# EasyEDA Pro project flyBuck_test.eprj

# Schematic Schematic1
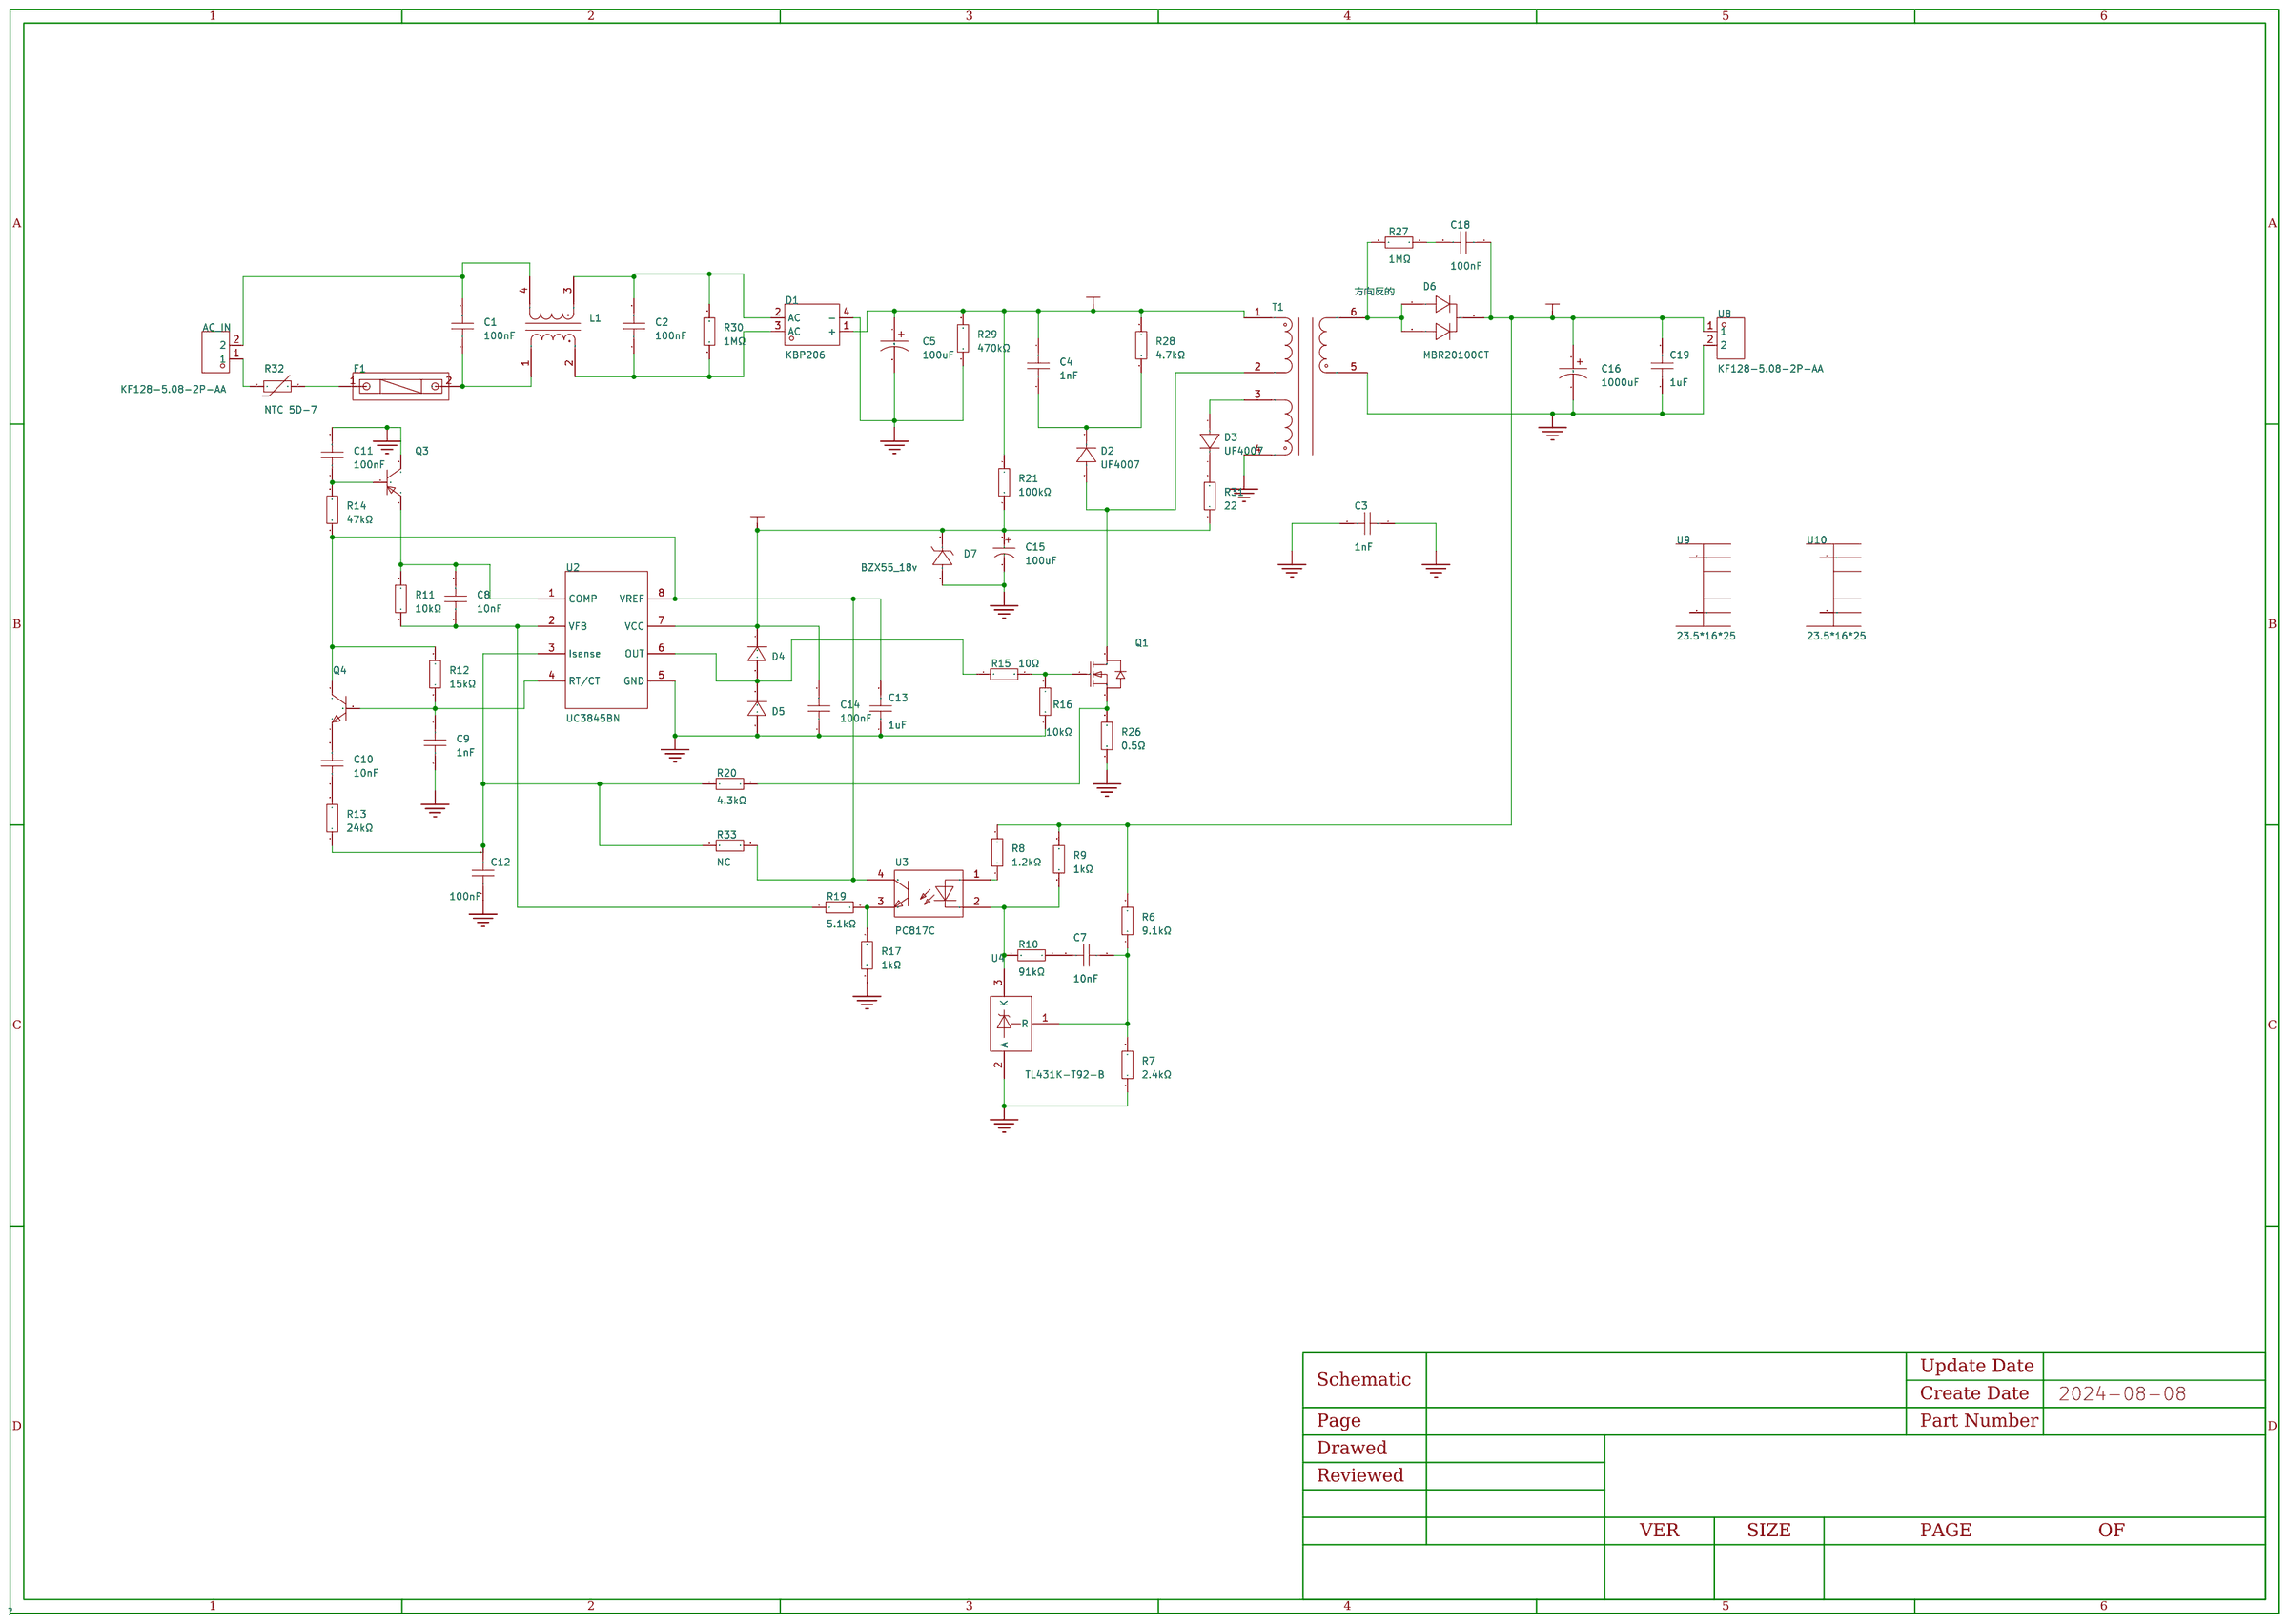
[diagram p0: schematic sheet]

## Parts
AC_IN  KF128-5.08-2P-AA  [CONN-TH_P5.08_KF128-5.08-2P]
C1  100nF  [CAP-TH_L13.0-W6.0-P10.0-D0.6]
C2  100nF  [CAP-TH_L13.0-W6.0-P10.0-D0.6]
C3  1nF  [CAP-TH_L7.0-W3.5-P10.00-D0.6]
C4  1nF  [CAP-TH_L7.0-W3.5-P10.00-D0.6]
C5  100uF  [CAP-TH_BD22.0-P10.00-D2.2-FD]
C7  10nF  [CAP-TH_L5.8-W2.4-P2.54-D0.6]
C8  10nF  [CAP-TH_L5.8-W2.4-P2.54-D0.6]
C9  1nF  [CAP-TH_L5.8-W2.4-P2.54-D0.6]
C10  10nF  [CAP-TH_L5.8-W2.4-P2.54-D0.6]
C11  100nF  [CAP-TH_L5.8-W2.4-P2.54-D0.6]
C12  100nF  [CAP-TH_L5.8-W2.4-P2.54-D0.6]
C13  1uF  [CAP-TH_L6.0-W4.0-P5.00-D1.2]
C14  100nF  [CAP-TH_L5.8-W2.4-P2.54-D0.6]
C15  100uF  [CAP-TH_BD6.3-P2.50-D1.0-FD]
C16  1000uF  [CAP-TH_BD10.0-P5.00-D1.0-FD]
C18  100nF  [CAP-TH_L5.8-W2.4-P2.54-D0.6]
C19  1uF  [CAP-TH_L6.0-W4.0-P5.00-D1.2]
D1  KBP206  [KBP_4P-L14.5-W3.5-P3.81-L]
D2  UF4007  [DO-41_BD2.4-L4.7-P8.70-D0.9-RD]
D3  UF4007  [DO-41_BD2.4-L4.7-P8.70-D0.9-RD]
D4  1N4148  [DO-35_BD2.0-L4.2-P8.20-D0.5-RD]
D5  1N4148  [DO-35_BD2.0-L4.2-P8.20-D0.5-RD]
D6  MBR20100CT  [TO-220AB-3_L10.4-W4.6-P2.54-T]
D7  BZX55_18v  [DO-35_BD1.7-L3.6-P10.00-D0.5-FD]
F1  5x20 BLX-A型 保险丝支架 XC-7  [FUSE-TH_L22.6-W9.0]
L1  YDUU9.8-103L0301  [FILTER-TH_4P-L16.5-W11.5_YDUU9.8-603L0201]
Q1  FQP6N80C  [TO220_safe600v]
Q3  S8550  [TO-92-3_L5.1-W4.1-P1.27-L]
Q4  S8050  [TO-92-3_L4.5-W3.5-P1.27-L]
R6  9.1kΩ  [RES-TH_BD1.9-L3.3-P7.30-D0.5]
R7  2.4kΩ  [RES-TH_BD1.9-L3.3-P7.30-D0.5]
R8  1.2kΩ  [RES-TH_BD1.9-L3.3-P7.30-D0.5]
R9  1kΩ  [RES-TH_BD1.9-L3.3-P7.30-D0.5]
R10  91kΩ  [RES-TH_BD1.9-L3.3-P7.30-D0.5]
R11  10kΩ  [RES-TH_BD1.9-L3.3-P7.30-D0.5]
R12  15kΩ  [RES-TH_BD1.9-L3.3-P7.30-D0.5]
R13  24kΩ  [RES-TH_BD1.9-L3.3-P7.30-D0.5]
R14  47kΩ  [RES-TH_BD1.9-L3.3-P7.30-D0.5]
R15  10Ω  [RES-TH_BD1.9-L3.3-P7.30-D0.5]
R16  10kΩ  [RES-TH_BD1.9-L3.3-P7.30-D0.5]
R17  1kΩ  [RES-TH_BD1.9-L3.3-P7.30-D0.5]
R19  5.1kΩ  [RES-TH_BD1.9-L3.3-P7.30-D0.5]
R20  4.3kΩ  [RES-TH_BD1.9-L3.3-P7.30-D0.5]
R21  100kΩ  [Resis_3W_ZC_LC]
R26  0.5Ω  [R2010]
R27  1MΩ  [resis_1W_ZC_LC]
R28  4.7kΩ  [Resis_3W_ZC_LC]
R29  470kΩ  [resis_1W_ZC_LC]
R30  1MΩ  [RES-TH_BD2.3-L6.5-P10.50-D0.5]
R31  22  [R1210]
R32  NTC 5D-7  [RES-TH_L8.5-W5.5-P5.00-D0.6-S5.50]
R33  NC  [RES-TH_BD1.9-L3.3-P7.30-D0.5]
T1  -  [EE28_5_5_L]
U2  UC3845BN  [DIP-8_L10.9-W6.6-P2.54-LS7.6-BL]
U3  PC817C  [DIP-4_L4.6-W6.5-P2.54-LS7.6-BL]
U4  TL431K-T92-B  [TO-92-3_L4.9-W3.7-P1.27-L]
U8  KF128-5.08-2P-AA  [CONN-TH_P5.08_KF128-5.08-2P]
U9  23.5*16*25  [HEATSINK-TH_L23.5-W16.0-P18.0_XSD2156-067]
U10  23.5*16*25  [HEATSINK-TH_L23.5-W16.0-P18.0_XSD2156-067]

## Library data of the parts
AC_IN U8 = KF128-5.08-2P-AA: LCSC Part Name: 5.08mm 1x2P 排数:1 每排P数:2 直插; Supplier Part: C474952; Manufacturer: KEFA(科发); Supplier Footprint: 插件,P=5.08mm; JLCPCB Part Class: 扩展库; Datasheet: https://atta.szlcsc.com/upload/public/pdf/source/20230317/DADFED05827EAD48C1D5B8C3D4CF88F4.pdf; Supplier: LCSC; Structure: 1x2P; Pitch: 5.08mm; Color: 绿色; Mounting Style: 直插; Current Rating (Max): 24A; Voltage Rating (Max): 250V; Number of Pins: 2P; Number of Rows: 1; Wire Gauge - AWG: 12~22; Wire Gauge - mm2: 2.5; Number of PINs Per Row: 2; Operating Temperature Range: -40℃~+105℃
C1 C2 = X2-104K-275VAC_C914483: LCSC Part Name: 等级:X2 100nF ±10% 275V; Supplier Part: C914483; Manufacturer: NDF(达孚); Manufacturer Part: X2-104K-275VAC; Supplier Footprint: 插件,P=10mm; JLCPCB Part Class: 扩展库; Datasheet: https://atta.szlcsc.com/upload/public/pdf/source/20210517/C914484_87B6324D9C831D7B5ED24756D36395BD.pdf; Supplier: LCSC; Tolerance: ±10%; Voltage(AC): 275V; Subclass: X2; Operating Temperature: -40℃~+110℃
C3 C4 = Y1680K-E1I-B4-AC400V: LCSC Part Name: 等级:Y1 68pF ±10% 400V; Supplier Part: C3148245; Manufacturer: Dersonic(德尔创); Supplier Footprint: 插件,P=10mm; JLCPCB Part Class: 扩展库; Datasheet: https://atta.szlcsc.com/upload/public/pdf/source/20220706/A63904B1A025BA519904ED28C3950901.pdf; Supplier: LCSC; Tolerance: ±10%; Voltage(AC): 400V; Subclass: Y1; safety certification: UL；CUL；ENEC；VDE；CQC; Operating Temperature: -40℃~+125℃
C5 = 152EC0349: LCSC Part Name: 100uF ±20% 400V; Supplier Part: C5563861; Manufacturer: KNSCHA(科尼盛); Supplier Footprint: 插件,D22xL25mm; JLCPCB Part Class: 扩展库; Datasheet: https://atta.szlcsc.com/upload/public/pdf/source/20230425/64684703988C9F344EAF36C2E534ED51.pdf; Supplier: LCSC; Tolerance: ±20%; Rated Voltage: 400V; Lead Spacing: 10mm; Ripple Current: 630mA@120Hz; φD: 22mm; L: 25mm; Lifetime @ Temperature: 2000hrs@105℃; Operating Temperature: -25℃~+105℃
C7-C12 C14 C18 = CC1H104ZA1ED3F5P1100: LCSC Part Name: 100nF -20%~+80% 50V; Supplier Part: C2832506; Manufacturer: Dersonic(德尔创); Supplier Footprint: 插件,P=2.54mm; JLCPCB Part Class: 扩展库; Datasheet: https://atta.szlcsc.com/upload/public/pdf/source/20211027/619020FDD8EBC9BBFCA73A5584FA164D.pdf; Supplier: LCSC; Tolerance: -20%~+80%; Voltage Rated: 50V; Lead Spacing: 2.54mm; Temperature Coefficient: Y5V; φD: 5.8mm; Body Thickness: 2.4mm
C13 C19 = CT40805B104K500F3: LCSC Part Name: 104K50V P=5  独石电容; Supplier Part: C25168941; Manufacturer: KYET(科雅); Supplier Footprint: 插件,P=5.08mm; Datasheet: https://atta.szlcsc.com/upload/public/pdf/source/20240710/2A9D5485CB0DC7110878DC42BC2098C0.pdf; Supplier: LCSC
C15 = ERS1EM101E11OT: LCSC Part Name: 100uF ±20% 25V; Supplier Part: C112509; Manufacturer: AISHI(艾华集团); Supplier Footprint: 插件,D6.3xL11mm; JLCPCB Part Class: 扩展库; Datasheet: https://atta.szlcsc.com/upload/public/pdf/source/20191015/C438940_4B8E60A742BB0AE40DDEF87A5C89089D.pdf; Supplier: LCSC; Tolerance: ±20%; Rated Voltage: 25V; Lead Spacing: 2.5mm; φD: 6.3mm; L: 11mm; Lifetime @ Temp: 5000hrs@105℃
C16 = 01EC4294SHC1000UF25V: LCSC Part Name: 1000uF ±20% 25V; Supplier Part: C503217; Manufacturer: KNSCHA(科尼盛); Supplier Footprint: 插件,D10xL16mm; JLCPCB Part Class: 扩展库; Datasheet: https://atta.szlcsc.com/upload/public/pdf/source/20240806/1082112373C74E03ED6704D18D61A53D.pdf; Supplier: LCSC; Tolerance: ±20%; Rated Voltage: 25V; Ripple Current: 450mA@120Hz; Lead Spacing: 5mm; φD: 10mm; L: 16mm; Lifetime @ Temp: 5000hrs@105℃
D1 = KBP206_C7507386: LCSC Part Name: 电压:600V 电流:2A; Supplier Part: C7507386; Manufacturer: HXY MOSFET(华轩阳电子); Supplier Footprint: KBP; JLCPCB Part Class: 扩展库; Datasheet: https://atta.szlcsc.com/upload/public/pdf/source/20230913/5DD558DAD6A87BD319B418C5EAFBC156.pdf; Supplier: LCSC; Forward Voltage (Vf@If): 1.1V@2A; Reverse Voltage (Vr): 600V; Average Rectified Current (Io): 2A; Peak Forward Surge Current: 60A
D2 D3 = UF4007_C960666: LCSC Part Name: 电压:1kV 电流:1A; Supplier Part: C960666; Manufacturer: MDD(辰达半导体); Supplier Footprint: DO-41; JLCPCB Part Class: 扩展库; Datasheet: https://atta.szlcsc.com/upload/public/pdf/source/20230823/1B30A65DCB3ACA14005A2F03886CEF7C.pdf; Supplier: LCSC; Forward Voltage (Vf@If): 1.7V@1A; Reverse Voltage (Vr): 1kV; Rectified Current: 1A; Reverse Leakage Current: 5uA@1kV; Reverse Recovery Time (trr): 75ns; Operating Temperature: -50℃~+150℃@(Tj)
D4 D5 = 1N4148_C402212: LCSC Part Name: 电压:75V 电流:150mA; Supplier Part: C402212; Manufacturer: LGE(鲁光); Supplier Footprint: DO-35; JLCPCB Part Class: 扩展库; Datasheet: https://atta.szlcsc.com/upload/public/pdf/source/20190705/C402212_D6CD0A8EA8714742E0940C7C02C37BFA.pdf; Supplier: LCSC; Forward Voltage (Vf@If): 1V@10mA; Reverse Voltage (Vr): 75V; Average Rectified Current (Io): 150mA; Power Dissipation: 500mW; Reverse Leakage Current: 5uA@75V; Reverse Recovery Time (trr): 4ns
D6 = MBR20100CT_C173465: LCSC Part Name: 电压:100V 电流:20A; Supplier Part: C173465; Manufacturer: MDD(辰达半导体); Supplier Footprint: TO-220AB-3; JLCPCB Part Class: 扩展库; Datasheet: https://atta.szlcsc.com/upload/public/pdf/source/20230823/019C3101C6749BCDCCD7AF8DE8E356AE.pdf; Supplier: LCSC; Diode Configuration: 1对共阴极; Forward Voltage (Vf@If): 850mV@10A; Reverse Voltage (Vr): 100V; Rectified Current: 20A; Reverse Leakage Current (Ir): 1mA@100V
D7 = BZX55C9V1_1: LCSC Part Name: BZX55C9V1; Supplier Part: C5158984; Manufacturer: LGE(鲁光); Supplier Footprint: DO-35; JLCPCB Part Class: 扩展库; Datasheet: https://atta.szlcsc.com/upload/public/pdf/source/20220914/666E1C756BAD5E5D5272F57264F7673F.pdf; Supplier: LCSC; Diode Configuration: 独立式; Zener Voltage (Nom): 9.1V; Reverse Leakage Current (Ir): 100nA; Zener Voltage (Range): 8.65V~9.56V; Power Dissipation: 500mW; Zener Impedance (Zzt): 5Ω
F1 = 5x20 BLX-A型 保险丝支架 XC-7: LCSC Part Name: 保险丝座 5x20 BLX-A型; Supplier Part: C3131; Manufacturer: xcfuse(旭程); Supplier Footprint: 插件; JLCPCB Part Class: 扩展库; Datasheet: https://atta.szlcsc.com/upload/public/pdf/source/20240729/DC1D3219E24C0947FE01EC5C0866C942.pdf; Supplier: LCSC
L1 = YDUU9.8-103L0301: LCSC Part Name: UU9.8 10mH @1KHz; Supplier Part: C5174477; Manufacturer: YJYCOIN(益嘉源); Supplier Footprint: 插件; JLCPCB Part Class: 扩展库; Datasheet: https://atta.szlcsc.com/upload/public/pdf/source/20230925/D5DB9F01761B17A23CF8DD0F34CC6277.pdf; Supplier: LCSC; Number of Lines: 2; Withstanding Voltage: 1.5kV@AC; Inductance @ Frequency: 10mH@1KHz
Q1 = FQP6N80C: LCSC Part Name: N沟道 耐压:800V 电流:5.5A; Supplier Part: C462766; Manufacturer: onsemi(安森美); Supplier Footprint: TO-220; JLCPCB Part Class: 扩展库; Datasheet: https://atta.szlcsc.com/upload/public/pdf/source/20221020/B5F1FBD9CB76702574208DE2BC63A082.pdf; Supplier: LCSC; Type: N沟道; Drain Source Voltage (Vdss): 800V; Continuous Drain Current (Id): 5.5A; Power Dissipation (Pd): 158W; Drain Source On Resistance (RDS(on)@Vgs,Id): 2.5Ω@10V,2.75A; Gate Threshold Voltage (Vgs(th)@Id): 5V@250uA; Total Gate Charge (Qg@Vgs): 30nC@10V; Input Capacitance (Ciss@Vds): 1.31nF@25V; Operating Temperature: -55℃~+150℃@(Tj)
Q3 = S8550_C2826361: LCSC Part Name: PNP 电流:500mA 耐压:25V; Supplier Part: C2826361; Manufacturer: Slkor(萨科微); Supplier Footprint: TO-92-3; JLCPCB Part Class: 扩展库; Datasheet: https://atta.szlcsc.com/upload/public/pdf/source/20210420/C2826361_F8583ED516CD850F9D81319D1DD5830C.pdf; Supplier: LCSC; Transistor Type: PNP; Collector Current (Ic): 500mA; Collector-Emitter Breakdown Voltage (Vceo): 25V; Power Dissipation (Pd): 625mW; Transition Frequency (fT): 150MHz; Collector Cut-Off Current (Icbo): 100nA; Collector-Emitter Saturation Voltage (VCE(sat)@Ic,Ib): 600mV@500mA,50mA
Q4 = S8050_C2931492: LCSC Part Name: NPN 电流:500mA 耐压:25V; Supplier Part: C2931492; Manufacturer: JSMSEMI(杰盛微); Supplier Footprint: TO-92-3; JLCPCB Part Class: 扩展库; Datasheet: https://atta.szlcsc.com/upload/public/pdf/source/20240105/D4E57AD221AC7DEA1E31B953388D993E.pdf; Supplier: LCSC; Transistor Type: NPN; Collector Current (Ic): 500mA; Collector-Emitter Breakdown Voltage (Vceo): 25V; Power Dissipation (Pd): 625mW; DC Current Gain (hFE@Ic,Vce): 160@50mA,1V; Transition Frequency (fT): 150MHz; Collector Cut-Off Current (Icbo): 100nA; Collector-Emitter Saturation Voltage (VCE(sat)@Ic,Ib): 600mV@500mA,50mA
R6-R17 R19 R20 R33 = MFR0W8F1001A50: LCSC Part Name: 1kΩ ±1% 125mW 金属膜电阻; Supplier Part: C58674; Manufacturer: UNI-ROYAL(厚声); Supplier Footprint: 插件,D1.9xL3.3mm; JLCPCB Part Class: 扩展库; Datasheet: https://atta.szlcsc.com/upload/public/pdf/source/20191012/C436293_8820AA14BC71FA35E551C06C441482A0.pdf; Supplier: LCSC; Type: 金属膜电阻; Tolerance: ±1%; Overload Voltage (Max): 200V; Power(Watts): 125mW; Temperature Coefficient: ±50ppm/℃
R21 R27-R29 = MF1/4CCT52A4701F: LCSC Part Name: 金属膜电阻 4.7kΩ ±1% 250mW; Supplier Part: C315658; Manufacturer: KOA; Supplier Footprint: 插件,D2.3xL6.3mm; JLCPCB Part Class: 扩展库; Datasheet: https://atta.szlcsc.com/upload/public/pdf/source/20181022/C315658_C46CA32D4E3C6888835115017B2433E5.pdf; Supplier: LCSC; Type: 金属膜电阻; Tolerance: ±1%; Power(Watts): 250mW; Temperature Coefficient: ±50ppm/℃
R26 = Res_2010: Supplier Footprint: 2010
R30 = RI40-1/4W-10KΩ±5%T: LCSC Part Name: 玻璃釉电阻 10kΩ ±5% 250mW 粉色漆; Supplier Part: C714634; Manufacturer: 华星机电; Supplier Footprint: 插件; JLCPCB Part Class: 扩展库; Datasheet: https://atta.szlcsc.com/upload/public/pdf/source/20200731/C714531_AD63ADE1939354DF9C89AA88364E3DE5.pdf; Supplier: LCSC; Type: 玻璃釉电阻; Tolerance: ±5%; Power(Watts): 250mW; Temperature Coefficient: ±200ppm/℃; Operating Temperature Range: -55℃~+125℃
R31 = Res_1210: Supplier Footprint: 1210
R32 = NTC 5D-7: LCSC Part Name: 5Ω; Supplier Part: C5385; Manufacturer: RUILON(瑞隆源); Supplier Footprint: 插件,P=5mm; JLCPCB Part Class: 扩展库; Datasheet: https://atta.szlcsc.com/upload/public/pdf/source/20180410/C207392_007A1CB20DB6E487C695D7783FF0F5F9.pdf; Supplier: LCSC; Resistance @ 25℃: 5Ω; Steady State Current (Max): 2A; Operating Temperature: -55℃~+200℃
T1 = EE25_7P
U2 = UC3845BN: Supplier Part: C5175; Manufacturer: ST(意法半导体); Supplier Footprint: DIP-8; JLCPCB Part Class: 扩展库; Datasheet: https://atta.szlcsc.com/upload/public/pdf/source/20121229/1457706572683.pdf; Supplier: LCSC; Supply Voltage: 7.6V~30V; Switching Frequency: 500kHz; Duty Cycle: 48%; Topology: 反激式；升压式; Operating Temperature: -40℃~+150℃@(Tj)
U3 = PC817C_C3025068: Supplier Part: C3025068; Manufacturer: GOODWORK(固得沃克); Supplier Footprint: DIP-4; JLCPCB Part Class: 扩展库; Datasheet: https://atta.szlcsc.com/upload/public/pdf/source/20220530/3FD5D572B823BA05C967330A07ECF74F.pdf; Supplier: LCSC
U4 = TL431K-T92-B: Supplier Part: C71131; Manufacturer: UTC(友顺); Supplier Footprint: TO-92; JLCPCB Part Class: 扩展库; Datasheet: https://atta.szlcsc.com/upload/public/pdf/source/20161217/1481939214245.pdf; Supplier: LCSC; Output Type: 可编程; Input Voltage: 2.495V; Output Voltage: 2.5V~36V; Output Current: 100mA; Operating Temperature: -40℃~+85℃@(TA)
U9 U10 = 23.5*16*25: LCSC Part Name: 23.5*16*25   2个钉散热片; Supplier Part: C4661; Manufacturer: XSD(鑫顺达); JLCPCB Part Class: 扩展库; Datasheet: https://atta.szlcsc.com/upload/public/pdf/source/20180404/C4661_AA4279CA2C163B7D4FDABF987BD2FAA9.pdf; Supplier: LCSC; brand: XSD(鑫顺达); ProductSize: 23.5*16*25MM; Colour: 白色; TextureOfMaterial: 6063-T5铝; SurfaceTreatment: 本色洗白; NumberOfNails: 2

## Nets
+15V: C16.1 C18.1 C19.2 D6.2(C) R6.2 R8.2 R9.2 U8.1
GND: C3.1 C16.2 C19.1 R7.1 T1.5 U4.2(A) U8.2
PGND: C3.2 C5.2 C9.1 C11.2 C12.1 C13.1 C14.1 C15.2 D1.4(-) D5.2(A) D7.1(K) Q3.3(C) R16.2 R17.2 R26.1 R29.1 T1.4 U2.5(GND)
VBUS: C4.1 C5.1 D1.1(+) R21.1 R28.2 R29.2 T1.1
UC_VCC: C14.2 C15.1 D4.1(C) D7.2(A) R21.2 R31.1 U2.7(VCC)
$1N1250: AC_IN.2 C1.2 L1.4
$1N1260: C2.1 D1.3(AC) L1.2 R30.1
$1N1266: C2.2 D1.2(AC) L1.3 R30.2
$1N2378: AC_IN.1 R32.1
$1N2489: C4.2 D2.1(K) R28.1
$1N2599: Q1.3(S) R20.2 R26.2
$1N3704: C7.2 R6.1 R7.2 U4.1(R)
$1N3792: R9.1 R10.2 U3.2(CAT) U4.3(K)
$1N3797: R8.1 U3.1(AN)
$1N3894: C7.1 R10.1
$1N4221: C8.1 R11.1 R19.1 U2.2(VFB)
$1N4229: C8.2 Q3.1(E) R11.2 U2.1(COMP)
$1N4274: C9.2 Q4.2(B) R12.1 U2.4(RT/CT)
$1N4360: C13.2 Q4.3(C) R12.2 R14.1 R33.2 U2.8(VREF) U3.4(COL)
$1N4475: C10.1 R13.2
$1N4641: C10.2 Q4.1(E)
$1N4716: C11.1 Q3.2(B) R14.2
$1N4845: C12.2 R13.1 R20.1 R33.1 U2.3(Isense)
$1N4965: D4.2(A) D5.1(C) R15.2 U2.6(OUT)
$1N5253: Q1.1(G) R15.1 R16.1
$1N5344: R17.1 R19.2 U3.3(EM)
$1N8496: D6.1(A) D6.3(A) R27.2 T1.6
$1N14212: C18.2 R27.1
$1N19874: D3.1(K) R31.2
$1N20136: F1.1 R32.2
$1N20189: C1.1 F1.2 L1.1
Net-(D2-2): D2.2(A) Q1.2(D) T1.2
Net-(D3-2): D3.2(A) T1.3

Not connected (* = marked no-connect by the designer): U9 1 2; U10 1 2

## Notes on the sheet
- 方向反的

# Board PCB1
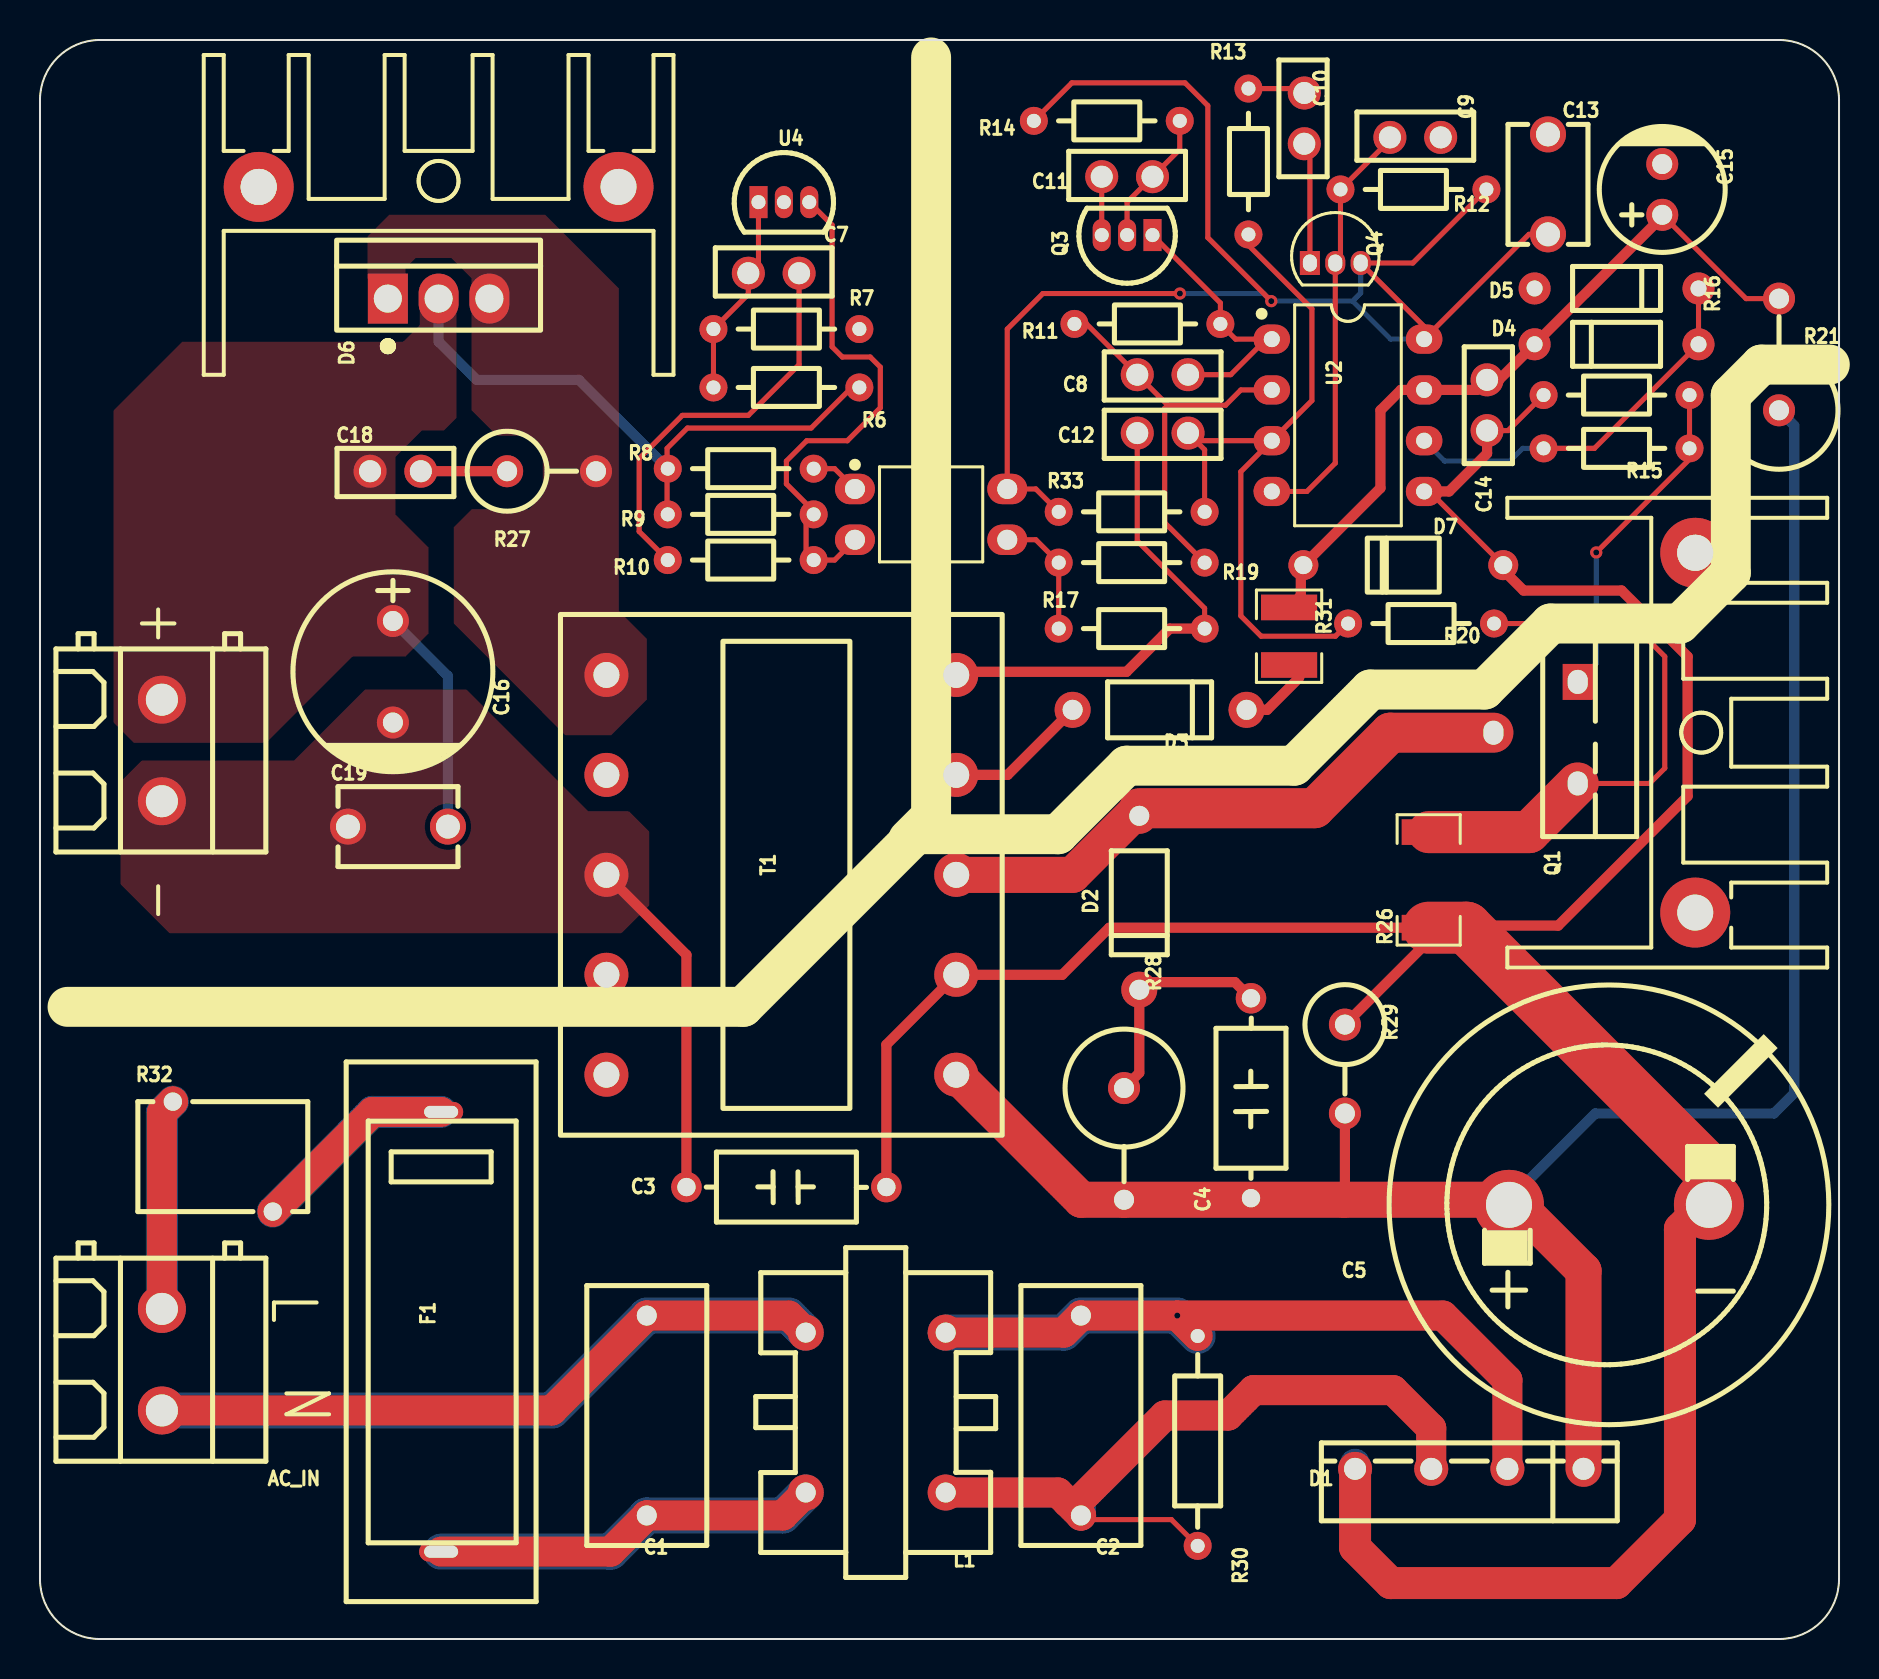
[diagram p1: board, top side]
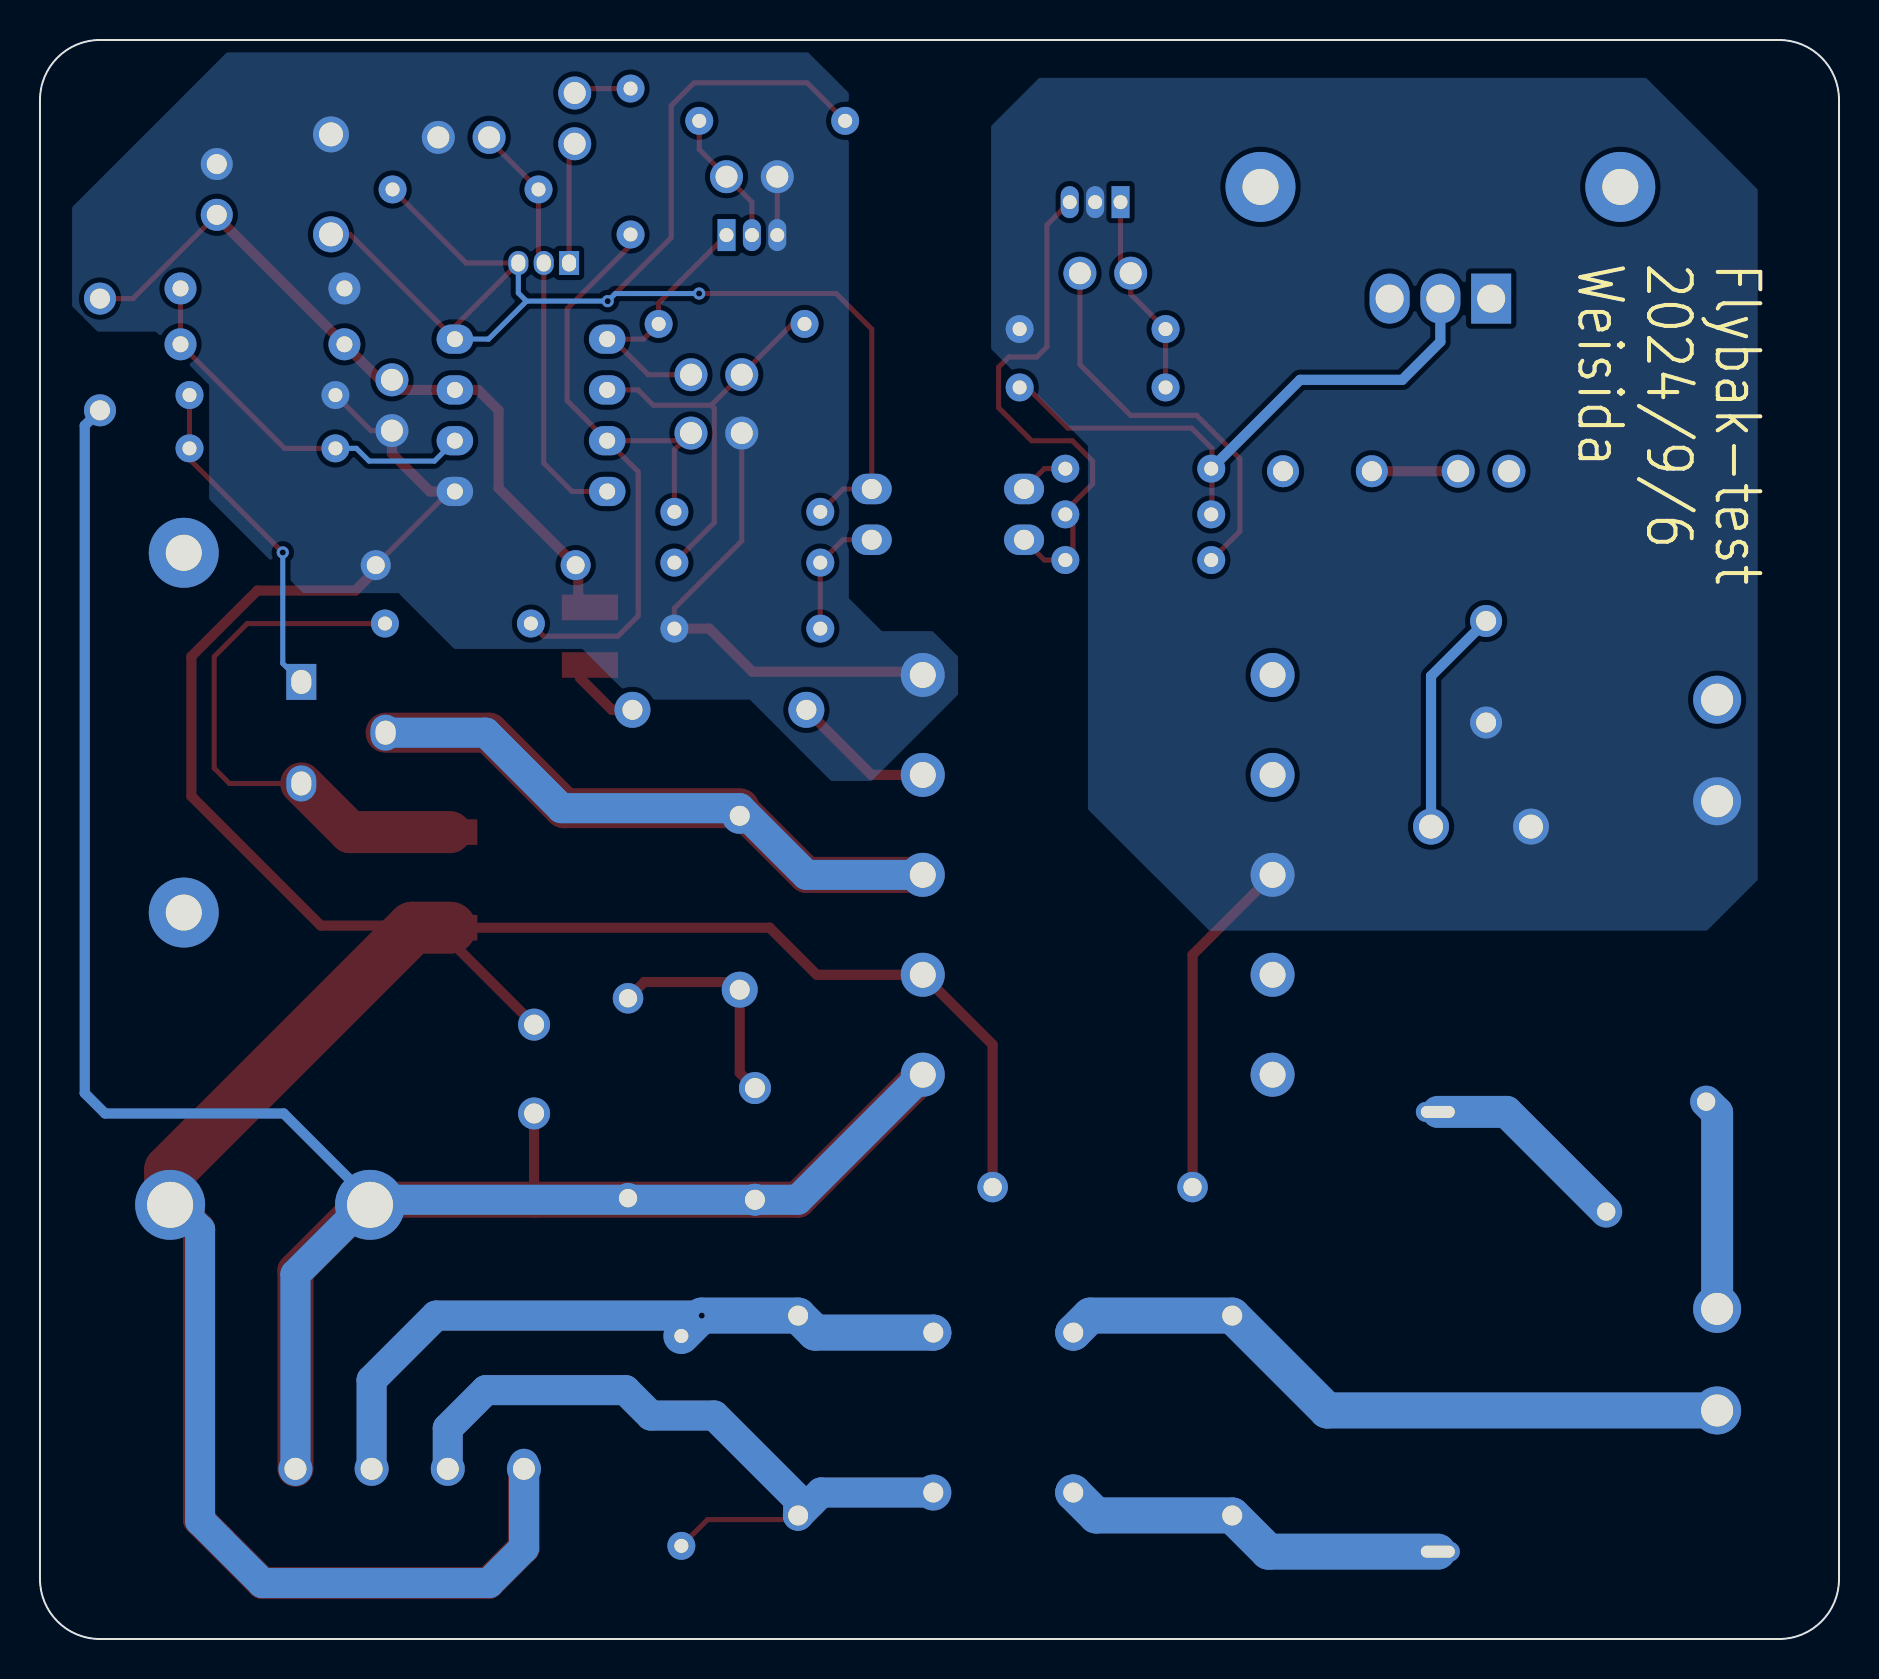
[diagram p2: board, bottom side, seen from below]

Outline 90 x 80 mm; copper layers: Top Layer, Bottom Layer. Coordinates in mm from the lower left corner of the outline.
Outline path: 0,77 0,3 arc(0.88,0.88) 3,0 87,0 arc(89.12,0.88) 90,3 90,77 arc(89.12,79.12) 87,80 3,80 arc(0.88,79.12) 0,77
Stack: Top Layer 0.035mm / Dielectric1 1.51mm FR4 er 4.5 / Bottom Layer 0.035mm

## Design rules (mm)
template: 自定义配置
spacing copperThickness1oz (default): track to track 0.127, other pairs 0.152 to 0.3
spacing copperThickness2oz: track to track 0.203, other pairs 0.152 to 0.3
spacing safeClearance400_600V: track to track 3.2, other pairs 0.152 to 3.2
spacing safeClearance300_400V: track to track 1.999, other pairs 1.001 to 2.499
track width copperThickness1oz (default): min 0.127, default 0.254, max 5.08
track width copperThickness2oz: min 0.203, default 0.254, max 2.54
differential pair differentialPair (default): width min 0.127, default 0.254, max 2.54; gap min 0.152, default 0.152
via viaSize (default): diameter min 0.5, default 0.61, max 10; hole min 0.3, default 0.305, max 6.299

## Placement (name value [footprint] x y rotation side)
AC_IN  KF128-5.08-2P-AA  [CONN-TH_P5.08_KF128-5.08-2P]  6.1 13.97 270 top
C1  100nF  [CAP-TH_L13.0-W6.0-P10.0-D0.6]  30.36 11.18 90 top
C2  100nF  [CAP-TH_L13.0-W6.0-P10.0-D0.6]  52.07 11.18 90 top
C3  1nF  [CAP-TH_L7.0-W3.5-P10.00-D0.6]  37.34 22.61 0 top
C4  1nF  [CAP-TH_L7.0-W3.5-P10.00-D0.6]  60.58 27.06 90 top
C5  100uF  [CAP-TH_BD22.0-P10.00-D2.2-FD]  78.49 21.72 0 top
C7  10nF  [CAP-TH_L5.8-W2.4-P2.54-D0.6]  36.71 68.33 180 top
C8  10nF  [CAP-TH_L5.8-W2.4-P2.54-D0.6]  56.16 63.25 0 top
C9  1nF  [CAP-TH_L5.8-W2.4-P2.54-D0.6]  68.8 75.13 180 top
C10  10nF  [CAP-TH_L5.8-W2.4-P2.54-D0.6]  63.25 76.08 270 top
C11  100nF  [CAP-TH_L5.8-W2.4-P2.54-D0.6]  54.38 73.16 180 top
C12  100nF  [CAP-TH_L5.8-W2.4-P2.54-D0.6]  56.16 60.33 0 top
C13  1uF  [CAP-TH_L6.0-W4.0-P5.00-D1.2]  75.44 72.78 270 top
C14  100nF  [CAP-TH_L5.8-W2.4-P2.54-D0.6]  72.39 61.73 90 top
C15  100uF  [CAP-TH_BD6.3-P2.50-D1.0-FD]  81.16 72.52 90 top
C16  1000uF  [CAP-TH_BD10.0-P5.00-D1.0-FD]  17.66 48.39 270 top
C18  100nF  [CAP-TH_L5.8-W2.4-P2.54-D0.6]  17.78 58.42 0 top
C19  1uF  [CAP-TH_L6.0-W4.0-P5.00-D1.2]  17.91 40.64 0 top
D1  KBP206  [KBP_4P-L14.5-W3.5-P3.81-L]  71.5 8.51 180 top
D2  UF4007  [DO-41_BD2.4-L4.7-P8.70-D0.9-RD]  54.99 36.83 90 top
D3  UF4007  [DO-41_BD2.4-L4.7-P8.70-D0.9-RD]  56.01 46.49 180 top
D4  1N4148  [DO-35_BD2.0-L4.2-P8.20-D0.5-RD]  78.87 64.77 0 top
D5  1N4148  [DO-35_BD2.0-L4.2-P8.20-D0.5-RD]  78.87 67.57 180 top
D6  MBR20100CT  [TO-220AB-3_L10.4-W4.6-P2.54-T]  19.94 67.06 90 top
D7  BZX55_18v  [DO-35_BD1.7-L3.6-P10.00-D0.5-FD]  68.2 53.73 180 top
F1  5x20 BLX-A型 保险丝支架 XC-7  [FUSE-TH_L22.6-W9.0]  20.07 15.37 270 top
L1  YDUU9.8-103L0301  [FILTER-TH_4P-L16.5-W11.5_YDUU9.8-603L0201]  41.81 11.33 180 top
Q1  FQP6N80C  [TO220_safe600v]  76.71 45.34 270 top
Q3  S8550  [TO-92-3_L5.1-W4.1-P1.27-L]  54.38 70.24 180 top
Q4  S8050  [TO-92-3_L4.5-W3.5-P1.27-L]  64.8 68.84 0 top
R6  9.1kΩ  [RES-TH_BD1.9-L3.3-P7.30-D0.5]  37.34 62.62 0 top
R7  2.4kΩ  [RES-TH_BD1.9-L3.3-P7.30-D0.5]  37.34 65.54 180 top
R8  1.2kΩ  [RES-TH_BD1.9-L3.3-P7.30-D0.5]  35.05 58.55 180 top
R9  1kΩ  [RES-TH_BD1.9-L3.3-P7.30-D0.5]  35.05 56.27 180 top
R10  91kΩ  [RES-TH_BD1.9-L3.3-P7.30-D0.5]  35.05 53.98 0 top
R11  10kΩ  [RES-TH_BD1.9-L3.3-P7.30-D0.5]  55.4 65.79 0 top
R12  15kΩ  [RES-TH_BD1.9-L3.3-P7.30-D0.5]  68.71 72.52 0 top
R13  24kΩ  [RES-TH_BD1.9-L3.3-P7.30-D0.5]  60.45 73.92 90 top
R14  47kΩ  [RES-TH_BD1.9-L3.3-P7.30-D0.5]  53.37 75.95 0 top
R15  10Ω  [RES-TH_BD1.9-L3.3-P7.30-D0.5]  78.87 59.57 180 top
R16  10kΩ  [RES-TH_BD1.9-L3.3-P7.30-D0.5]  78.87 62.23 180 top
R17  1kΩ  [RES-TH_BD1.9-L3.3-P7.30-D0.5]  54.61 50.55 0 top
R19  5.1kΩ  [RES-TH_BD1.9-L3.3-P7.30-D0.5]  54.61 53.85 180 top
R20  4.3kΩ  [RES-TH_BD1.9-L3.3-P7.30-D0.5]  69.09 50.8 0 top
R21  100kΩ  [Resis_3W_ZC_LC]  87 61.47 90 top
R26  0.5Ω  [R2010]  69.47 37.98 90 top
R27  1MΩ  [resis_1W_ZC_LC]  23.37 58.42 0 top
R28  4.7kΩ  [Resis_3W_ZC_LC]  54.23 27.56 270 top
R29  470kΩ  [resis_1W_ZC_LC]  65.28 30.74 270 top
R30  1MΩ  [RES-TH_BD2.3-L6.5-P10.50-D0.5]  57.91 9.91 90 top
R31  22  [R1210]  62.49 50.17 270 top
R32  NTC 5D-7  [RES-TH_L8.5-W5.5-P5.00-D0.6-S5.50]  9.15 24.13 0 top
R33  NC  [RES-TH_BD1.9-L3.3-P7.30-D0.5]  54.61 56.39 180 top
T1  -  [EE28_5_5_L]  37.09 38.23 90 top
U2  UC3845BN  [DIP-8_L10.9-W6.6-P2.54-LS7.6-BL]  65.43 61.22 270 top
U3  PC817C  [DIP-4_L4.6-W6.5-P2.54-LS7.6-BL]  44.58 56.27 270 top
U4  TL431K-T92-B  [TO-92-3_L4.9-W3.7-P1.27-L]  37.21 71.89 0 top
U8  KF128-5.08-2P-AA  [CONN-TH_P5.08_KF128-5.08-2P]  6.1 44.45 270 top
U9  23.5*16*25  [HEATSINK-TH_L23.5-W16.0-P18.0_XSD2156-067]  82.81 45.34 270 top
U10  23.5*16*25  [HEATSINK-TH_L23.5-W16.0-P18.0_XSD2156-067]  19.94 72.65 0 top

## Footprints (pads in the part's own frame, mm; a bottom-side part is the same pattern mirrored in y, then rotated)
CAP-TH_BD6.3-P2.50-D1.0-FD
  round 1.6 hole 1: 1(-1.27,0) 2(1.27,0)
CAP-TH_BD10.0-P5.00-D1.0-FD
  round 1.6 hole 1: 1(-2.54,0) 2(2.54,0)
CAP-TH_BD22.0-P10.00-D2.2-FD
  round 3.5 hole 2.3: 1(-5,0) 2(5,0)
CAP-TH_L5.8-W2.4-P2.54-D0.6
  round 1.65 hole 1.1: 1(-1.27,0) 2(1.27,0)
CAP-TH_L6.0-W4.0-P5.00-D1.2
  round 1.8 hole 1.2: 1(-2.5,0) 2(2.5,0)
CAP-TH_L7.0-W3.5-P10.00-D0.6
  round 1.524 hole 0.914: 1(-5,0) 2(5,0)
CAP-TH_L13.0-W6.0-P10.0-D0.6
  round 1.524 hole 1: 1(-5,0) 2(5,0)
CONN-TH_P5.08_KF128-5.08-2P
  round 2.4 hole 1.6: 1(-2.54,0) 2(2.54,0)
DIP-4_L4.6-W6.5-P2.54-LS7.6-BL
  oval 1.524x2 hole 1: 1(-1.27,-3.81) 2(1.27,-3.81) 3(1.27,3.81) 4(-1.27,3.81)
DIP-8_L10.9-W6.6-P2.54-LS7.6-BL
  oval 1.462x1.827 hole 0.8: 1(-3.81,-3.81) 2(-1.27,-3.81) 3(1.27,-3.81) 4(3.81,-3.81) 5(3.81,3.81) 6(1.27,3.81) 7(-1.27,3.81) 8(-3.81,3.81)
DO-35_BD1.7-L3.6-P10.00-D0.5-FD
  round 1.5 hole 0.9: 1(-5,0) 2(5,0)
DO-35_BD2.0-L4.2-P8.20-D0.5-RD
  round 1.6 hole 0.8: 1(-4.1,0) 2(4.1,0)
DO-41_BD2.4-L4.7-P8.70-D0.9-RD
  round 1.8 hole 1: 1(-4.35,0) 2(4.35,0)
EE28_5_5_L
  round 2.2 hole 1.3: 1(-10,-8.75) 2(-5,-8.75) 3(0,-8.75) 4(5,-8.75) 5(10,-8.75) 6(10,8.75) 7(5,8.75) 8(0,8.75) 9(-5,8.75) 10(-10,8.75)
FILTER-TH_4P-L16.5-W11.5_YDUU9.8-603L0201
  round 1.8 hole 1: 1(3.5,4) 2(-3.5,4) 3(-3.5,-4) 4(3.5,-4)
FUSE-TH_L22.6-W9.0
  oval 1x2.2 hole 0.6x1.7: 1(-11,0) 2(11,0)
HEATSINK-TH_L23.5-W16.0-P18.0_XSD2156-067
  round 3.5 hole 1.8: 1(-9,0) 2(9,0)
KBP_4P-L14.5-W3.5-P3.81-L
  round 1.7 hole 1.1: 1(-5.715,0) 2(-1.905,0) 3(1.905,0) 4(5.715,0)
R1210
  rect 1.282x2.808 smd: 1(-1.441,0) 2(1.441,0)
R2010
  rect 1.282x2.7 smd: 1(-2.391,0) 2(2.391,0)
RES-TH_BD1.9-L3.3-P7.30-D0.5
  round 1.4 hole 0.7: 1(-3.65,0) 2(3.65,0)
RES-TH_BD2.3-L6.5-P10.50-D0.5
  round 1.4 hole 0.7: 1(-5.25,0) 2(5.25,0)
RES-TH_L8.5-W5.5-P5.00-D0.6-S5.50
  round 1.524 hole 0.914: 1(-2.5,2.75) 2(2.5,-2.75)
resis_1W_ZC_LC
  round 1.6 hole 1: 1(0,0) 2(4.445,0)
Resis_3W_ZC_LC
  round 1.6 hole 1: 1(0,0) 2(5.588,0)
TO220_safe600v
  rect 1.8x1.5 hole 1.2x1: 1(-2.54,0.215)
  oval 1.8x1.5 hole 1.2x1: 2(0,-4) 3(2.54,0.215)
TO-92-3_L4.5-W3.5-P1.27-L
  rect 1x1.2 hole 0.7x0.85: 1(-1.27,0)
  oval 1x1.2 hole 0.7x0.85: 2(0,0) 3(1.27,0)
TO-92-3_L4.9-W3.7-P1.27-L
  rect 0.9x1.6 hole 0.7: 1(-1.27,0)
  oval 0.9x1.6 hole 0.7: 2(0,0) 3(1.27,0)
TO-92-3_L5.1-W4.1-P1.27-L
  rect 0.9x1.6 hole 0.7: 1(-1.27,0)
  oval 0.9x1.6 hole 0.7: 2(0,0) 3(1.27,0)
TO-220AB-3_L10.4-W4.6-P2.54-T
  rect 2.5x2 hole 1.4: 1(0,2.54)
  oval 2.5x2 hole 1.4: 2(0,0) 3(0,-2.54)

## Nets
As in the schematic, except:
GND: C3.1 C16.2 C19.1 R7.1 T1.8 U4.2 U8.2
PGND: C3.2 C5.2 C9.1 C11.2 C12.1 C13.1 C14.1 C15.2 D1.4 D5.2 D7.1 Q3.3 R16.2 R17.2 R26.1 R29.1 T1.2 T1.5 U2.5
$1N2525: D2.2 Q1.2 T1.3
$1N19894: D3.2 T1.4

Pads without a net: T1 7 9 10; U9 1 2; U10 1 2

## Via types
v1: diameter 0.61, hole 0.305, Top Layer to Bottom Layer, 4 vias

## Routing (per net, layer and track width the routed paths; a pad name or vN(x,y) marks a point on that pad's centre or on a via; arc(x,y) is an arc through that point)
+15V: length 42.2
  Top Layer w0.254: 40.99,63 38.58,60.58 32.39,60.58 31.37,59.57 31.37,56.61 31.02,56.27
  Bottom Layer w0.508: 31.4,58.55 26.96,63 21.85,63 19.94,64.9 D6.2 ; 17.66,50.93 20.41,48.18 C19.2
GND: length 17.3
  Top Layer w0.508: T1.8 32.34,34.23 C3.1
PGND: length 214.6
  Top Layer w0.254: 58.26,50.55 58.26,51.57 54.89,54.94 54.89,60.33 ; C14.1 73.44,60.46 R16.2 ; D7.1 69.52,57.41 ; Q3.3 C11.2
  Top Layer w0.508: C3.2 42.34,29.74 T1.2 51.14,33.23 53.49,35.59 R26.1 69.47,34.93 R29.1 ; T1.5 46,48.39 54.36,48.39 56.52,50.55 58.26,50.55 ; 73.07,53.6 74.22,52.46 79.12,52.46 82.43,49.15 82.43,42.17 75.95,35.69 71.76,35.69 ; U2.5 70.49,57.41 72.39,59.31 C14.1
  Top Layer w1.6: D1.4 65.79,4.58 67.57,2.8 78.87,2.8 82.04,5.97 82.04,20.53 83.49,21.98
  Top Layer w2.6: 83.49,21.98 83.49,23.45 71.35,35.59 R26.1
  Bottom Layer w1.501: 83.49,21.98 81.99,20.47 81.99,5.92 78.87,2.8 67.54,2.8 65.79,4.55 65.79,8.77
VBUS: length 145.6
  Top Layer w0.508: R29.2 65.28,22.01 65.24,21.98
  Top Layer w1.801: D1.1 77.22,18.42 73.66,21.98 52.09,21.98 T1.1
  Bottom Layer w0.508: R21.1 87.76,60.71 87.76,27.31 86.74,26.29 77.81,26.29 73.49,21.98
  Bottom Layer w1.5: T1.1 52.09,21.98 73.49,21.98
  Bottom Layer w1.501: 73.49,21.98 77.22,18.25 77.22,8.77
UC_VCC: length 37.5
  Top Layer w0.254: C15.1 85.35,67.06 R21.2
  Top Layer w0.508: C15.1 81.16,71.16 D4.1 72.99,63 C14.2 71.89,62.49 U2.7 68.08,62.49 67.06,61.47 67.06,57.58 63.07,53.6 63.07,52.2 R31.1
$1N1250: length 69.1
  Top Layer w1.5: L1.4 37.46,16.18 C1.2 25.61,11.44 AC_IN.2
  Bottom Layer w1.801: AC_IN.2 25.61,11.44 C1.2 37.46,16.18 L1.4
$1N1260: length 67.6
  Top Layer w0.254: 51.82,5.97 56.6,5.97 R30.1
  Top Layer w1.5: 51.42,6.83 51.91,6.83 56.26,11.18 59.44,11.18 60.71,12.45 67.69,12.45 69.6,10.55 D1.3 ; 51.42,6.83 50.92,7.33 L1.2 ; 51.42,6.83 C2.1
  Bottom Layer w1.5: C2.1 52.07,6.99 56.26,11.18 59.44,11.18 60.71,12.45 67.69,12.45 69.6,10.55 69.6,8.77
  Bottom Layer w1.501: C2.1 50.92,7.33 L1.2
$1N1266: length 71.1
  Top Layer w1.5: L1.3 51.22,15.33 C2.2 v1(56.89,16.18) ; v1(56.89,16.18) R30.2 ; v1(56.89,16.18) 70.19,16.18 73.41,12.96 D1.2
  Bottom Layer w1.5: v1(56.89,16.18) 70.19,16.18 73.41,12.96 73.41,8.77
  Bottom Layer w1.801: R30.2 v1(56.89,16.18) C2.2 51.22,15.33 L1.3
$1N2378: length 21.2
  Top Layer w1.501: R32.1 6.1,26.34 AC_IN.1
  Bottom Layer w1.6: R32.1 6.1,26.34 AC_IN.1
$1N2489: length 11.5
  Top Layer w0.508: R28.1 54.99,28.33 54.99,32.87 59.77,32.87 C4.2
$1N2525: length 59.6
  Top Layer w1.801: 54.99,41.57 51.66,38.23 T1.3
  Top Layer w1.999: Q1.2 67.55,45.34 63.77,41.57 54.99,41.57
  Bottom Layer w1.5: Q1.2 67.69,45.34 63.92,41.57 54.99,41.57 51.66,38.23 T1.3
$1N2599: length 27.9
  Top Layer w0.254: R20.2 79.63,50.8 81.28,49.15 81.28,43.57 80.52,42.8 Q1.3
  Top Layer w2.1: R26.2 74.49,40.37 Q1.3
$1N3704: length 9.8
  Top Layer w0.254: 33.69,63 R7.2 35.44,67.28 C7.2 35.94,68.84 U4.1
$1N3792: length 26.8
  Top Layer w0.254: R9.1 38.7,56.43 37.34,57.79 37.34,58.93 38.36,59.95 40.39,59.95 42.04,61.6 42.04,63.63 41.53,64.14 40.13,64.14 39.63,64.65 39.63,70.74 U4.3 ; 38.32,56.27 38.32,53.98 39.75,53.98 U3.2
$1N3797: length 2.9
  Top Layer w0.254: U3.1 39.75,58.55 38.32,58.55
$1N3894: length 20.2
  Top Layer w0.254: C7.1 37.98,63.76 35.44,61.22 32.13,61.22 29.97,59.06 29.97,55.41 31.4,53.98
$1N4221: length 20.6
  Top Layer w0.254: 56.42,61.73 52.35,65.79 R11.1 ; 56.42,61.73 56.26,61.57 56.26,55.85 58.26,53.85 ; 56.42,61.73 59.31,61.73 60.08,62.49 U2.2
$1N4229: length 13.4
  Top Layer w0.254: 61.35,65.03 61.62,65.03 ; 61.35,65.03 59.81,65.03 R11.2 59.05,66.84 Q3.1 ; 61.35,65.03 59.57,63.25 C8.2
$1N4274: length 21.2
  Top Layer w0.254: C9.2 67.53,74.99 R12.1 65.06,69.1 Q4.2 64.8,58.83 63.38,57.41 U2.4
$1N4360: length 78
  Top Layer w0.254: C13.2 74.49,70.28 69.24,65.03 69.24,65.67 Q4.3 68.68,68.84 R12.2 ; R33.2 49.82,57.54 U3.4 48.39,65.54 50.17,67.31 v1(57.03,67.31) ; v1(61.6,66.93) 58.42,70.11 58.42,76.71 57.28,77.86 51.62,77.86 R14.1
  Bottom Layer w0.254: 69.24,65.03 67.56,65.03 65.66,66.93 ; 65.66,66.93 v1(61.6,66.93) 61.22,67.31 v1(57.03,67.31) ; 65.66,66.93 66.07,67.34 Q4.3
$1N4475: length 2.9
  Top Layer w0.254: R13.2 63.03,77.57 C10.1
$1N4641: length 6.1
  Top Layer w0.254: 63.53,68.84 63.53,74.53 C10.2
$1N4716: length 6.8
  Top Layer w0.254: Q3.2 54.38,71.89 C11.1 57.02,74.52 57.02,75.95
$1N4845: length 36.2
  Top Layer w0.254: 61.62,59.95 57.81,59.95 ; 61.62,59.95 63.63,61.96 63.63,66.55 60.18,70 R13.1 ; 61.62,59.95 60.07,58.4 60.07,51.19 61.09,50.17 64.81,50.17 65.44,50.8 ; 57.81,59.95 C12.2 ; 57.81,59.95 58.26,59.5 58.26,56.39
$1N4965: length 19.4
  Top Layer w0.254: D5.1 D4.2 77.76,59.57 R15.2
  Bottom Layer w0.254: R15.2 74.17,59.57 73.54,58.93 70.26,58.93 69.24,59.95
$1N5253: length 16.7
  Top Layer w0.254: v1(77.85,54.36) 82.52,59.03 R15.1 R16.1
  Bottom Layer w0.254: v1(77.85,54.36) 77.85,48.81 76.93,47.88
$1N5344: length 6.3
  Top Layer w0.254: R17.1 R19.2 49.82,55 U3.3
$1N14212: length 4.3
  Top Layer w0.508: C18.2 R27.1
$1N19874: length 3.3
  Top Layer w0.508: D3.1 61.39,46.49 62.99,48.09
$1N19894: length 7.2
  Top Layer w0.508: D3.2 48.4,43.23 T1.4
$1N20136: length 21
  Top Layer w1.5: R32.2 16.63,26.37 F1.1
  Bottom Layer w1.6: R32.2 16.63,26.37 F1.1
$1N20189: length 38.9
  Top Layer w1.5: L1.1 37.16,6.18 C1.1 28.55,4.37 F1.2
  Bottom Layer w1.801: F1.2 28.55,4.37 C1.1 37.16,6.18 L1.1

## Copper pours and planes (outline as drawn; the poured copper is in the pictures)
+15V on Top Layer: 3.69,67.19 20.83,67.19 20.83,44.84 3.69,44.84
GND on Top Layer: 4.03,42.89 5.08,43.95 12.7,43.95 16.26,47.5 21.34,47.5 27.43,41.41 29.47,41.41 30.48,40.39 30.48,36.71 29.09,35.31 6.48,35.31 4.03,37.76
GND on Bottom Layer: 6.61,35.44 4.07,37.98 4.07,72.52 9.65,78.11 40.01,78.11 42.42,75.7 42.42,64.54 37.57,59.69 37.57,41.51 31.5,35.44
PGND on Bottom Layer: 49.53,77.35 51.56,79.38 80.65,79.38 88.39,71.63 88.39,66.68 87.12,65.41 84.2,65.41 81.54,62.74 81.54,57.03 76.83,52.33 72.06,52.33 69.27,49.53 62.87,49.53 60.33,46.99 54.49,46.99 50.42,42.93 48.39,42.93 44.07,47.25 44.07,49.16 45.34,50.42 47.88,50.42 49.53,52.07
$1N8496 on Top Layer: 20.7,57.79 26.29,57.79 26.29,45.22 20.7,45.22
$1N8496 on Top Layer: 21.59,69.09 30.36,69.09 30.36,45.22 21.59,45.22
$1N8496 on Top Layer: 16.39,71.25 27.43,71.25 27.43,67.95 16.39,67.95

## Text on the board
Bottom Silkscreen Layer: Flybak-test / 2024/9/6 / Weisida
Top Silkscreen Layer: N | + | - | L
